# EAGLE design amp_kt3102_summator_v_1_0 (EAGLE 6.4)
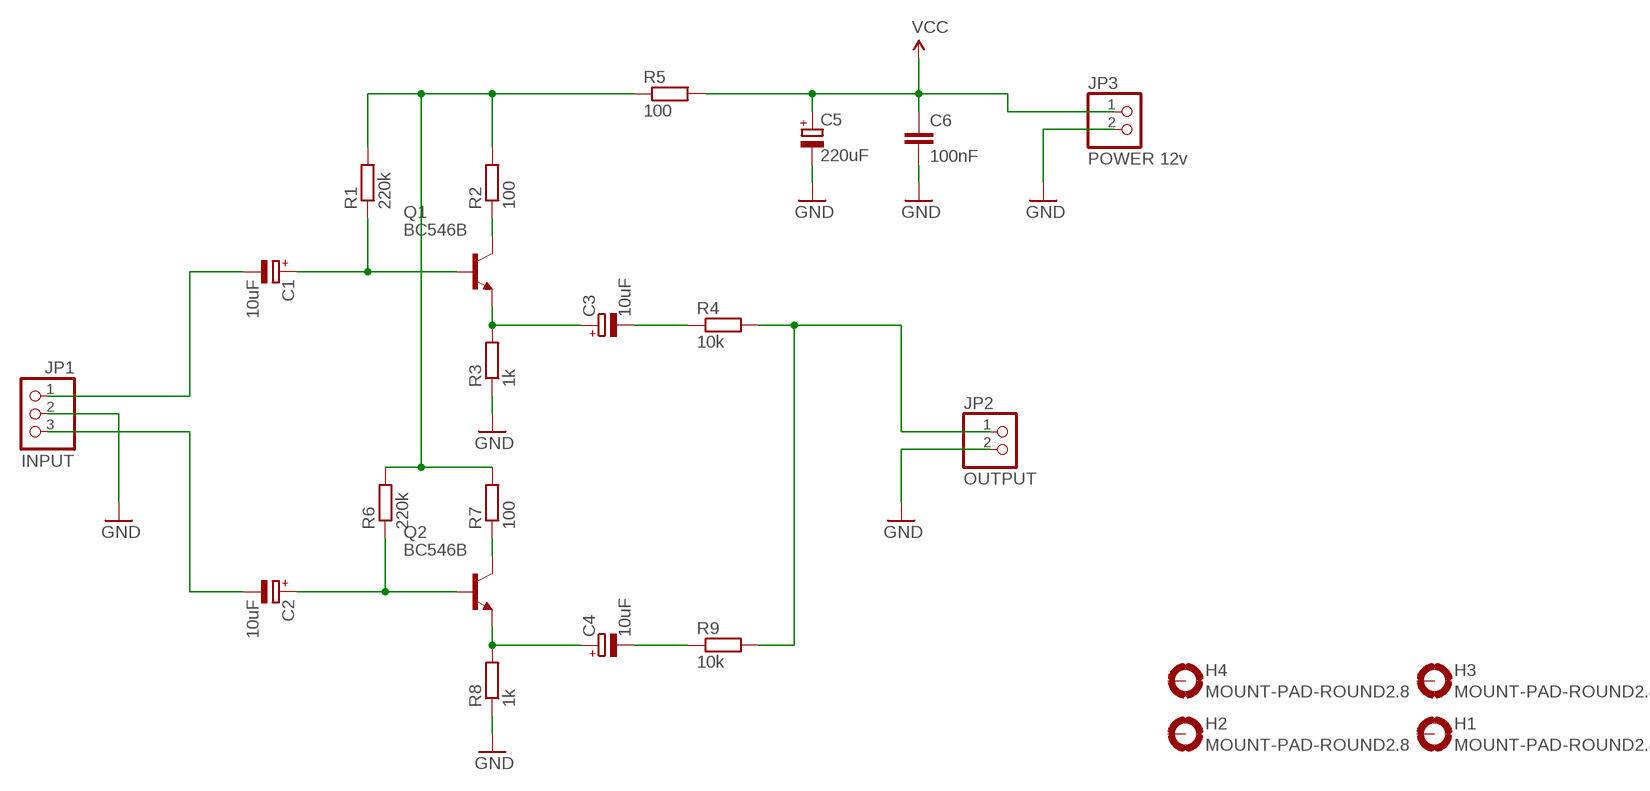
[diagram p0: schematic, sheet 1]

## Parts
C1  10uF  CPOL-EUE2.5-5  [E2,5-5]
C2  10uF  CPOL-EUE2.5-5  [E2,5-5]
C3  10uF  CPOL-EUE2.5-5  [E2,5-5]
C4  10uF  CPOL-EUE2.5-5  [E2,5-5]
C5  220uF  CPOL-EUE3.5-8  [E3,5-8]
C6  100nF  C-EU050-025X075  [C050-025X075]
H1  MOUNT-PAD-ROUND2.8  [2,8-PAD]
H2  MOUNT-PAD-ROUND2.8  [2,8-PAD]
H3  MOUNT-PAD-ROUND2.8  [2,8-PAD]
H4  MOUNT-PAD-ROUND2.8  [2,8-PAD]
JP1  INPUT  PINHD-1X3  [1X03]
JP2  OUTPUT  PINHD-1X2  [1X02]
JP3  POWER 12v  PINHD-1X2  [1X02]
Q1  BC546B  [TO92-EBC]
Q2  BC546B  [TO92-EBC]
R1  220k  R-EU_0204/7  [0204/7]
R2  100  R-EU_0204/7  [0204/7]
R3  1k  R-EU_0204/7  [0204/7]
R4  10k  R-EU_0204/7  [0204/7]
R5  100  R-EU_0204/7  [0204/7]
R6  220k  R-EU_0204/7  [0204/7]
R7  100  R-EU_0204/7  [0204/7]
R8  1k  R-EU_0204/7  [0204/7]
R9  10k  R-EU_0204/7  [0204/7]

## Nets
GND: C5.- C6.2 JP1.2 JP2.2 JP3.2 R3.1 R8.1
N$1: C1.- JP1.1
N$2: C1.+ Q1.B R1.1
N$3: Q1.C R2.1
N$4: R1.2 R2.2 R5.1 R6.2 R7.2
N$5: C3.+ Q1.E R3.2
N$7: C3.- R4.1
N$8: JP2.1 R4.2 R9.2
N$9: Q2.C R7.1
N$10: C2.+ Q2.B R6.1
N$11: C2.- JP1.3
N$12: C4.+ Q2.E R8.2
N$13: C4.- R9.1
VCC: C5.+ C6.1 JP3.1 R5.2
Unconnected: H1.B2,8(MOUNT) H2.B2,8(MOUNT) H3.B2,8(MOUNT) H4.B2,8(MOUNT)

## Library data of the parts
C1-C5 = rcl:CPOL-EU: POLARIZED CAPACITOR, European symbol
C6 = rcl:C-EU: CAPACITOR, European symbol
H1-H4 = holes:MOUNT-PAD-ROUND: MOUNTING PAD, round
JP1 = pinhead:PINHD-1X3: PIN HEADER
JP2 JP3 = pinhead:PINHD-1X2: PIN HEADER
Q1 Q2 = transistor-npn:BC546*: NPN Transistor
R1-R9 = rcl:R-EU_: RESISTOR, European symbol

## Board
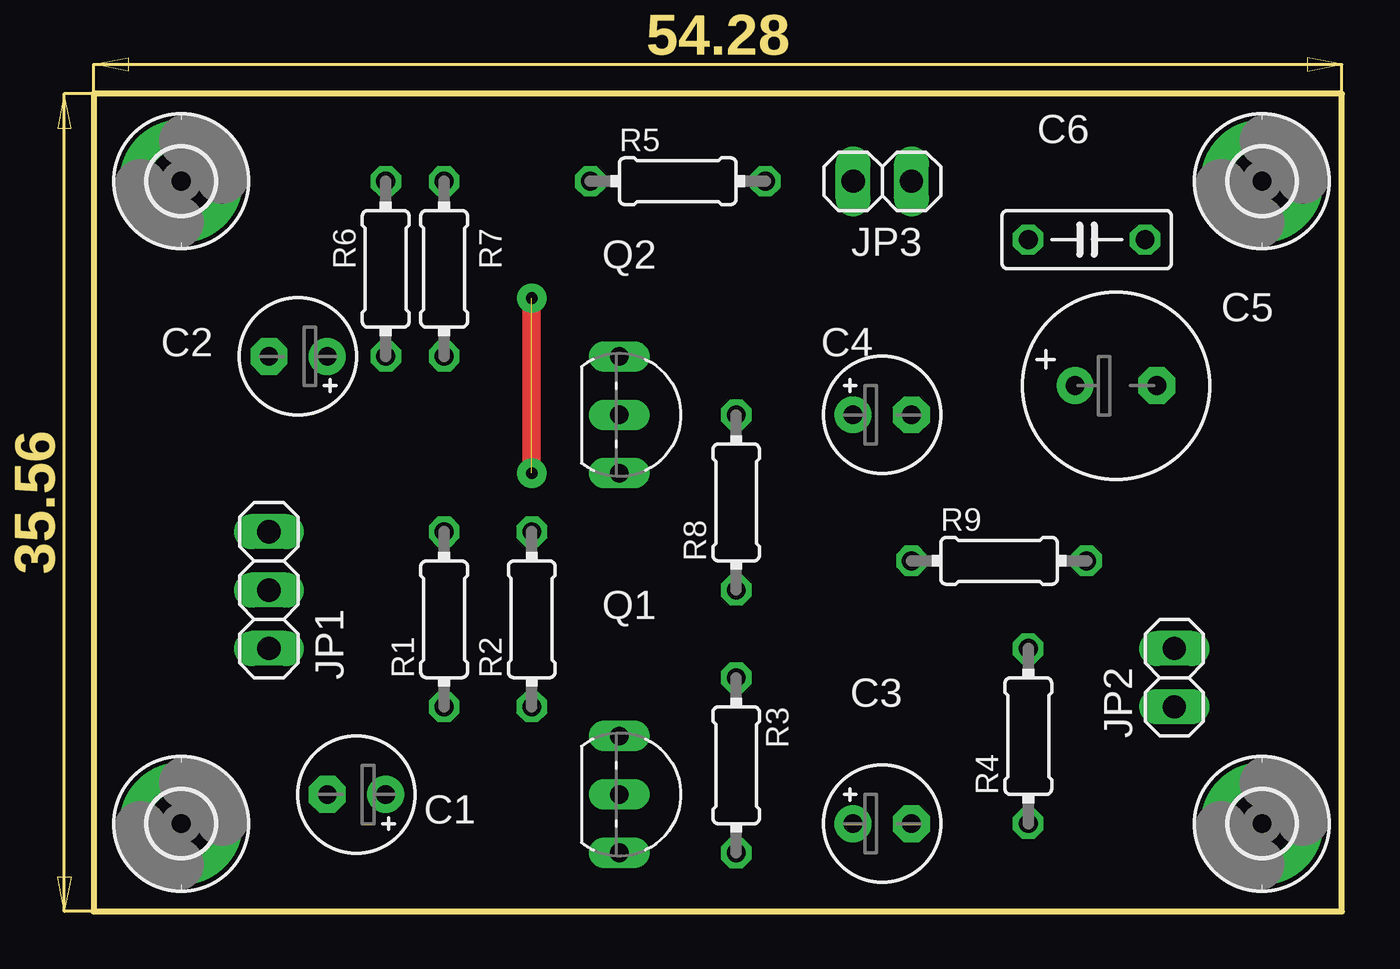
[diagram p1: board, top side]
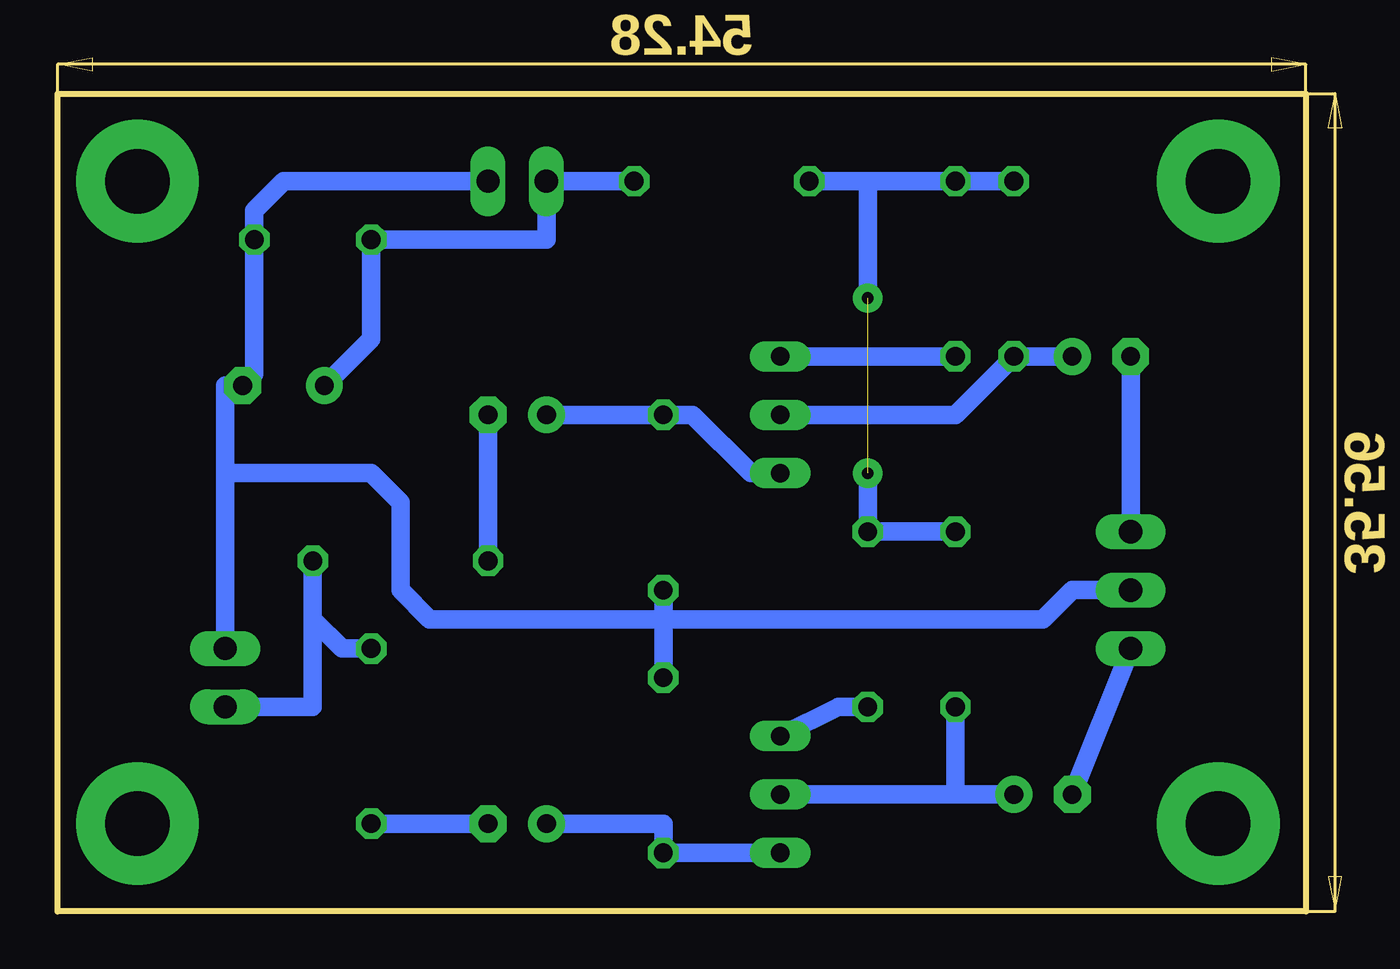
[diagram p2: board, bottom side, seen from below]

Size 54.28 x 35.55 mm. Coordinates in mm from the lower left corner, seen from the top.
Outline: 0,0 54.28,0 54.28,35.55 0,35.55 0,0
Copper layers (1*16): Top 0.035mm / dielectric 1.5mm / Bottom 0.035mm
Design rules "default": minimum track width 10mil, minimum drill 24mil, track to track 8mil, track to pad 8mil, pad to pad 8mil, via to via 8mil, smd to smd 8mil, copper to edge 40mil, drill to drill 8mil, minimum pad ring 10mil, minimum via ring 8mil, stop-mask expansion 4mil, vias tented up to drill 0mil, thermal gap 10mil

### Footprints (pad centres in the part's own frame; a part is rotated, then mirrored left to right if it is on the bottom)
E2,5-5 = drill 0.813 pad 1.6: + -1.27,0 | drill 0.813 pad 1.6 octagon: - 1.27,0
E3,5-8 = drill 0.813 pad 1.6: + -1.778,0 | drill 0.813 pad 1.6 octagon: - 1.778,0
C050-025X075 = drill 0.813 octagon: 1 -2.54,0; 2 2.54,0
2,8-PAD = drill 2.8 pad 5.334: B2,8 0,0
1X03 = drill 1.016 long: 1 -2.54,0; 2 0,0; 3 2.54,0
1X02 = drill 1.016 long: 1 -1.27,0; 2 1.27,0
TO92-EBC = drill 0.813 long: B 0,-1.27; C -2.54,-1.27; E 2.54,-1.27
0204/7 = drill 0.813 octagon: 1 -3.81,0; 2 3.81,0

### Placement (x,y rotation side)
C1  11.43,5.08 180 top
C2  8.89,24.13 180 top
C3  34.29,3.81 0 top
C4  34.29,21.59 0 top
C5  44.45,22.86 0 top
C6  43.18,29.21 0 top
H1  3.81,31.75 0 top
H2  3.81,3.81 0 top
H3  50.8,31.75 0 top
H4  50.8,3.81 0 top
JP1  7.62,13.97 90 top
JP2  46.99,10.16 90 top
JP3  34.29,31.75 0 top
Q1  24.13,5.08 270 top
Q2  24.13,21.59 270 top
R1  15.24,12.7 90 top
R2  19.05,12.7 90 top
R3  27.94,6.35 270 top
R4  40.64,7.62 90 top
R5  25.4,31.75 0 top
R6  12.7,27.94 90 top
R7  15.24,27.94 90 top
R8  27.94,17.78 90 top
R9  39.37,15.24 0 top

### Tracks (layer width: path | path; a pad name or v marks a point on that pad's centre or on a via)
GND
  Bottom 0.813: JP3.2 44.45,31.75 45.72,30.48 C6.2 45.72,23.37 C5.- 46.99,22.86 46.99,19.05 | JP1.2 10.16,13.97 11.43,12.7 27.94,12.7 | R3.1 27.94,12.7 | 46.99,19.05 JP2.2 | R8.1 27.94,12.7 | 27.94,12.7 38.1,12.7 39.37,13.97 39.37,17.78 40.64,19.05 46.99,19.05
N$1
  Bottom 0.813: JP1.1 C1.-
N$2
  Bottom 0.813: C1.+ 15.24,5.08 | R1.1 15.24,5.08 | 15.24,5.08 Q1.B
N$3
  Bottom 0.813: R2.1 20.32,8.89 Q1.C
N$4  (via drill 0.51 pad 1.27)  (1 unrouted)
  Top 0.813: v19.05,19.05 v19.05,26.67
  Bottom 0.813: R6.2 R7.2 19.05,31.75 | 19.05,31.75 R5.1 | R1.2 R2.2 v19.05,19.05 | 19.05,31.75 v19.05,26.67
N$5
  Bottom 0.813: Q1.E R3.2 27.94,3.81 C3.+
N$7
  Bottom 0.813: C3.- R4.1
N$8
  Bottom 0.813: R4.2 41.91,11.43 43.18,12.7 | 43.18,12.7 R9.2 | JP2.1 43.18,8.89 43.18,12.7
N$9
  Bottom 0.813: R7.1 Q2.C
N$10
  Bottom 0.813: C2.+ R6.1 15.24,21.59 Q2.B
N$11
  Bottom 0.813: JP1.3 C2.-
N$12
  Bottom 0.813: Q2.E 24.13,19.05 26.67,21.59 R8.2 C4.+
N$13
  Bottom 0.813: C4.- R9.1
VCC
  Bottom 0.813: R5.2 JP3.1 33.02,29.21 C6.1 40.64,24.89 C5.+